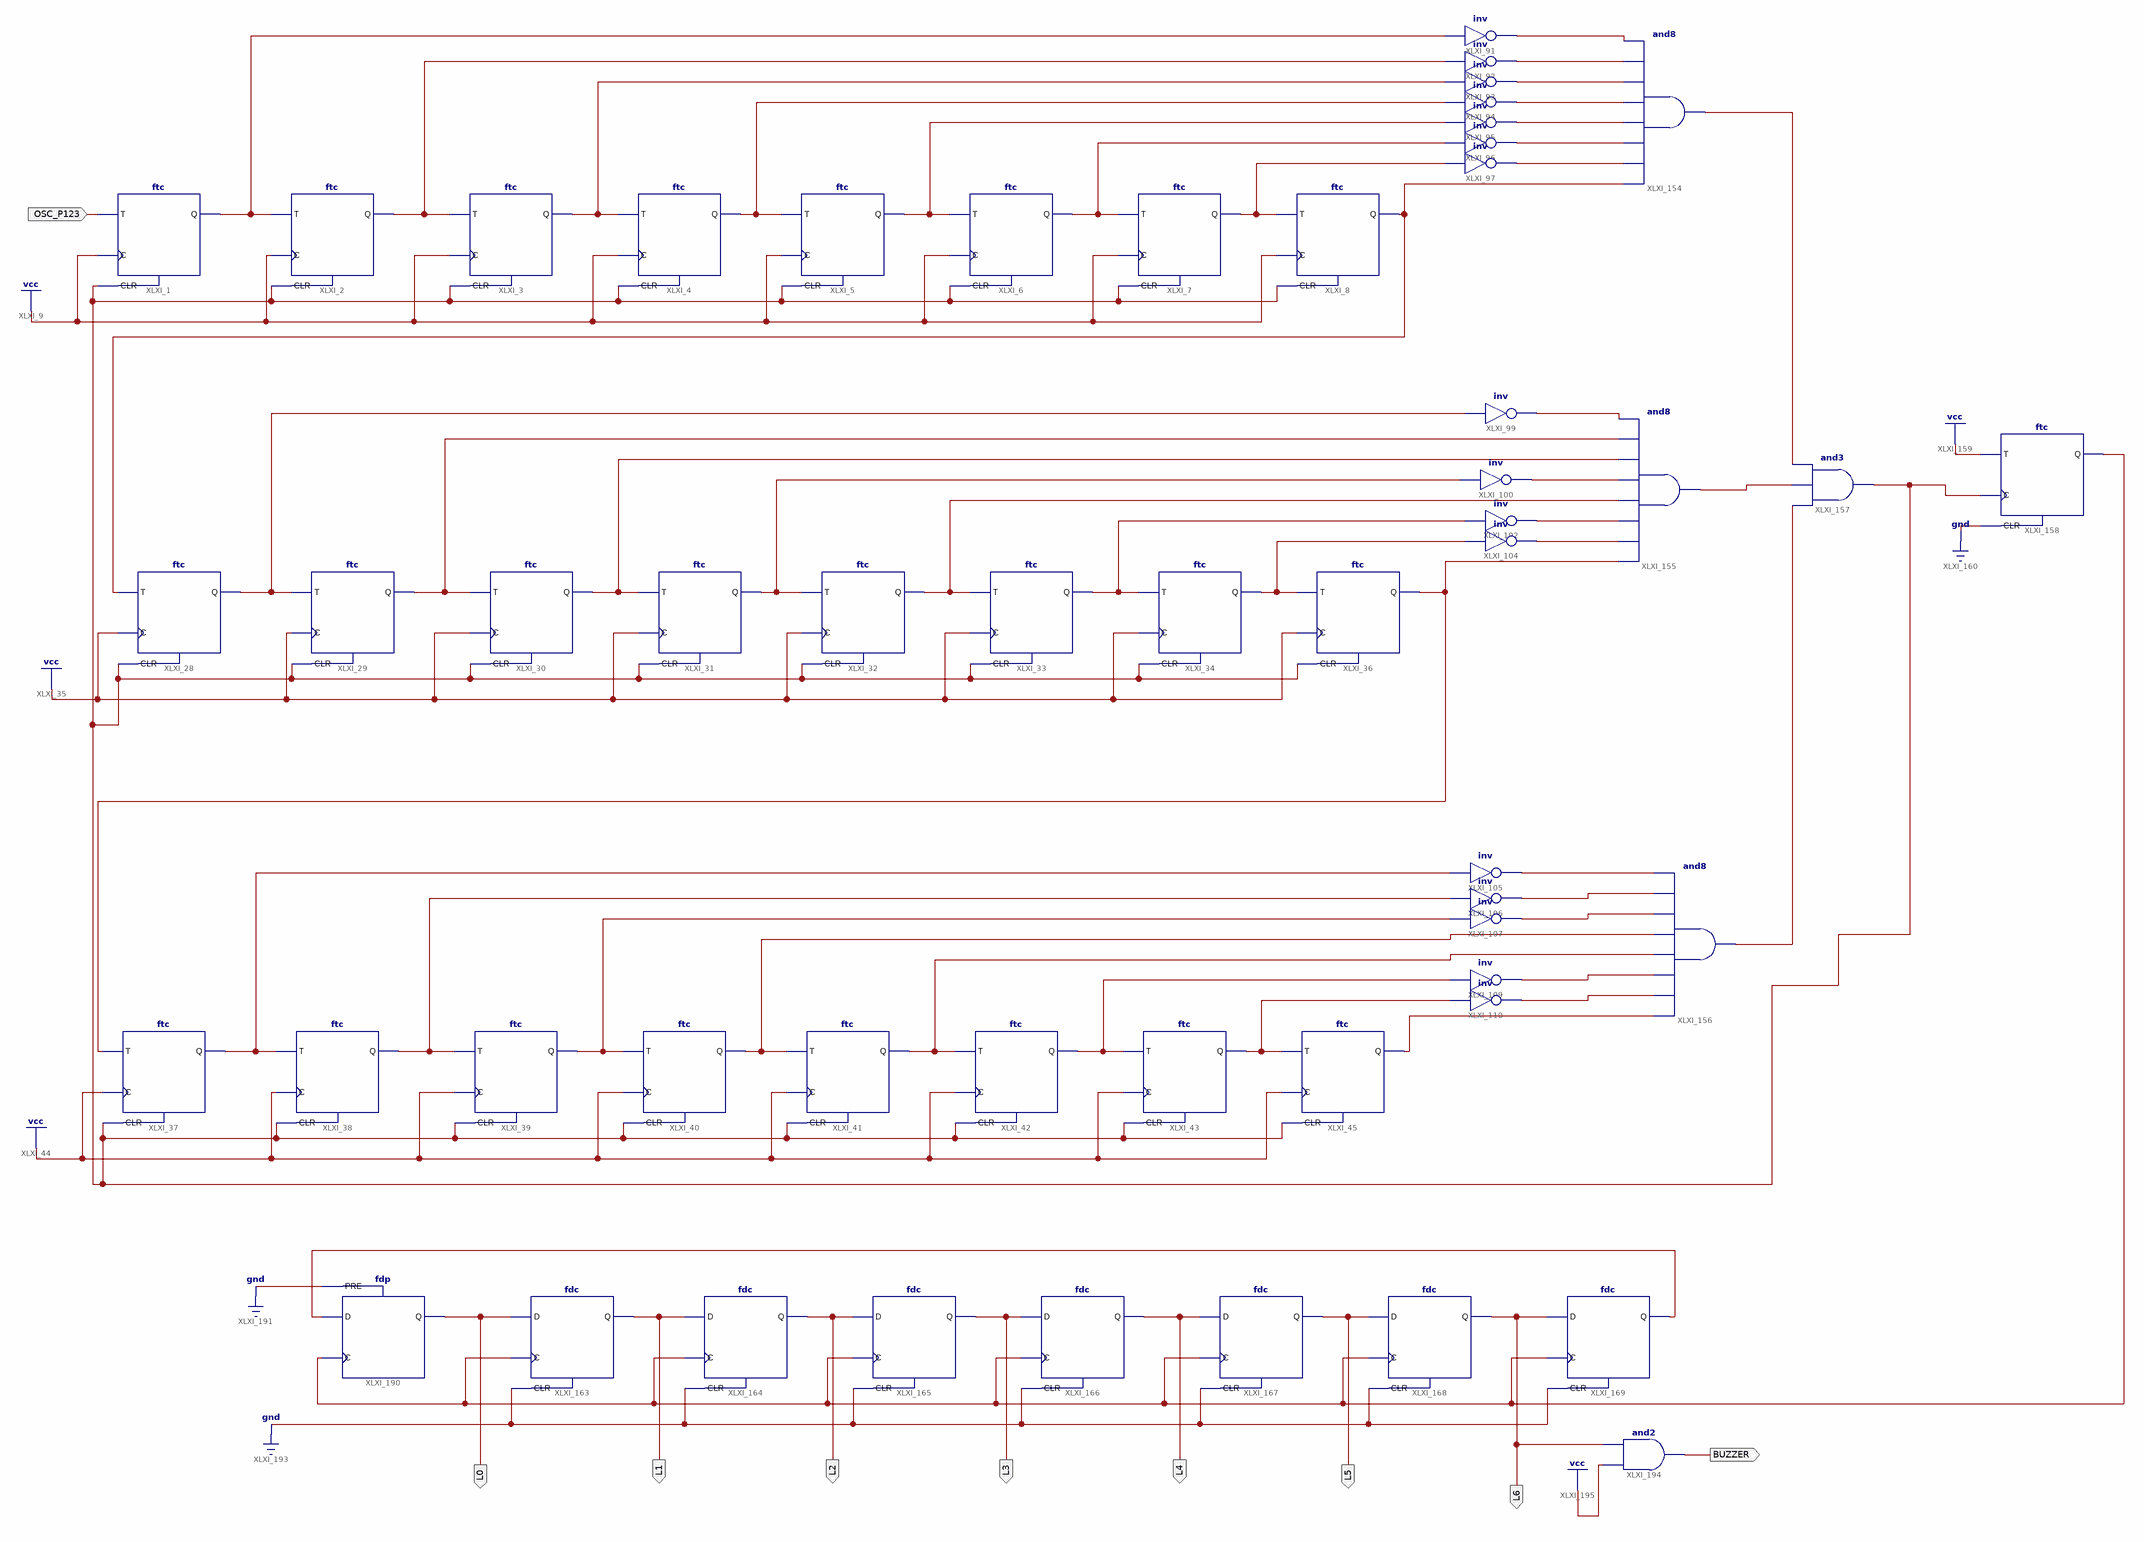
[diagram p0: schematic sheet 1]
// Xilinx ISE schematic lab8.sch (artix7) as structural Verilog: 54 symbols, 9 ports
module lab8 (
  input  OSC_P123,
  output L0,
  output L1,
  output L2,
  output L6,
  output BUZZER,
  output L5,
  output L3,
  output L4
);

  wire clock_1HZ, XLXN_20, XLXN_21, XLXN_22, XLXN_23, XLXN_24, XLXN_25, XLXN_26, XLXN_77, XLXN_79, XLXN_83,
       XLXN_87, XLXN_89, XLXN_96, XLXN_98, XLXN_104, XLXN_106, XLXN_108, XLXN_221, XLXN_291, XLXN_296,
       XLXN_297, XLXN_298, XLXN_302, XLXN_303, XLXN_304, XLXN_305, XLXN_306, XLXN_309, XLXN_310, XLXN_311,
       XLXN_312, XLXN_313, XLXN_314, XLXN_331, XLXN_332, XLXN_335, XLXN_336, XLXN_339, XLXN_340, XLXN_341,
       XLXN_423, XLXN_424, XLXN_426, XLXN_427, XLXN_440;

  ftc XLXI_1 (.C(1'b1), .CLR(XLXN_427), .T(OSC_P123), .Q(XLXN_26));
  ftc XLXI_2 (.C(1'b1), .CLR(XLXN_427), .T(XLXN_26), .Q(XLXN_25));
  ftc XLXI_3 (.C(1'b1), .CLR(XLXN_427), .T(XLXN_25), .Q(XLXN_24));
  ftc XLXI_4 (.C(1'b1), .CLR(XLXN_427), .T(XLXN_24), .Q(XLXN_23));
  ftc XLXI_5 (.C(1'b1), .CLR(XLXN_427), .T(XLXN_23), .Q(XLXN_22));
  ftc XLXI_6 (.C(1'b1), .CLR(XLXN_427), .T(XLXN_22), .Q(XLXN_21));
  ftc XLXI_7 (.C(1'b1), .CLR(XLXN_427), .T(XLXN_21), .Q(XLXN_20));
  ftc XLXI_8 (.C(1'b1), .CLR(XLXN_427), .T(XLXN_20), .Q(XLXN_305));
  ftc XLXI_28 (.C(1'b1), .CLR(XLXN_427), .T(XLXN_305), .Q(XLXN_89));
  ftc XLXI_29 (.C(1'b1), .CLR(XLXN_427), .T(XLXN_89), .Q(XLXN_87));
  ftc XLXI_30 (.C(1'b1), .CLR(XLXN_427), .T(XLXN_87), .Q(XLXN_309));
  ftc XLXI_31 (.C(1'b1), .CLR(XLXN_427), .T(XLXN_309), .Q(XLXN_83));
  ftc XLXI_32 (.C(1'b1), .CLR(XLXN_427), .T(XLXN_83), .Q(XLXN_311));
  ftc XLXI_33 (.C(1'b1), .CLR(XLXN_427), .T(XLXN_311), .Q(XLXN_79));
  ftc XLXI_34 (.C(1'b1), .CLR(XLXN_427), .T(XLXN_79), .Q(XLXN_77));
  ftc XLXI_36 (.C(1'b1), .CLR(XLXN_427), .T(XLXN_77), .Q(XLXN_314));
  ftc XLXI_37 (.C(1'b1), .CLR(XLXN_427), .T(XLXN_314), .Q(XLXN_108));
  ftc XLXI_38 (.C(1'b1), .CLR(XLXN_427), .T(XLXN_108), .Q(XLXN_106));
  ftc XLXI_39 (.C(1'b1), .CLR(XLXN_427), .T(XLXN_106), .Q(XLXN_104));
  ftc XLXI_40 (.C(1'b1), .CLR(XLXN_427), .T(XLXN_104), .Q(XLXN_336));
  ftc XLXI_41 (.C(1'b1), .CLR(XLXN_427), .T(XLXN_336), .Q(XLXN_339));
  ftc XLXI_42 (.C(1'b1), .CLR(XLXN_427), .T(XLXN_339), .Q(XLXN_98));
  ftc XLXI_43 (.C(1'b1), .CLR(XLXN_427), .T(XLXN_98), .Q(XLXN_96));
  ftc XLXI_45 (.C(1'b1), .CLR(XLXN_427), .T(XLXN_96), .Q(XLXN_221));
  // inv XLXI_91 has open pins: I=XLXN_26, O=open
  // inv XLXI_92 has open pins: I=XLXN_25, O=open
  // inv XLXI_95 has open pins: I=XLXN_22, O=open
  // inv XLXI_96 has open pins: I=XLXN_21, O=open
  // inv XLXI_97 has open pins: I=XLXN_20, O=open
  not XLXI_99 (XLXN_306, XLXN_89);
  // inv XLXI_100 has open pins: I=XLXN_83, O=open
  // inv XLXI_102 has open pins: I=XLXN_79, O=open
  not XLXI_93 (XLXN_297, XLXN_24);
  // inv XLXI_94 has open pins: I=XLXN_23, O=open
  // inv XLXI_104 has open pins: I=XLXN_77, O=open
  // inv XLXI_105 has open pins: I=XLXN_108, O=open
  // inv XLXI_106 has open pins: I=XLXN_106, O=open
  // inv XLXI_107 has open pins: I=XLXN_104, O=open
  // inv XLXI_109 has open pins: I=XLXN_98, O=open
  // inv XLXI_110 has open pins: I=XLXN_96, O=open
  and XLXI_154 (XLXN_423, XLXN_305, XLXN_304, XLXN_303, XLXN_302, XLXN_298, XLXN_297, XLXN_296, XLXN_291);
  and XLXI_155 (XLXN_424, XLXN_314, XLXN_313, XLXN_312, XLXN_311, XLXN_310, XLXN_309, XLXN_87, XLXN_306);
  and XLXI_156 (XLXN_426, XLXN_221, XLXN_341, XLXN_340, XLXN_339, XLXN_336, XLXN_335, XLXN_332, XLXN_331);
  and XLXI_157 (XLXN_427, XLXN_426, XLXN_424, XLXN_423);
  ftc XLXI_158 (.C(XLXN_427), .CLR(1'b0), .T(1'b1), .Q(clock_1HZ));
  fdc XLXI_163 (.C(clock_1HZ), .CLR(1'b0), .D(L0), .Q(L1));
  fdc XLXI_164 (.C(clock_1HZ), .CLR(1'b0), .D(L1), .Q(L2));
  fdc XLXI_165 (.C(clock_1HZ), .CLR(1'b0), .D(L2), .Q(L3));
  fdc XLXI_166 (.C(clock_1HZ), .CLR(1'b0), .D(L3), .Q(L4));
  fdc XLXI_167 (.C(clock_1HZ), .CLR(1'b0), .D(L4), .Q(L5));
  fdc XLXI_168 (.C(clock_1HZ), .CLR(1'b0), .D(L5), .Q(L6));
  fdc XLXI_169 (.C(clock_1HZ), .CLR(1'b0), .D(L6), .Q(XLXN_440));
  fdp XLXI_190 (.C(clock_1HZ), .D(XLXN_440), .PRE(1'b0), .Q(L0));
  and XLXI_194 (BUZZER, 1'b1, L6);
endmodule
